# Altium project controller.PrjPcb
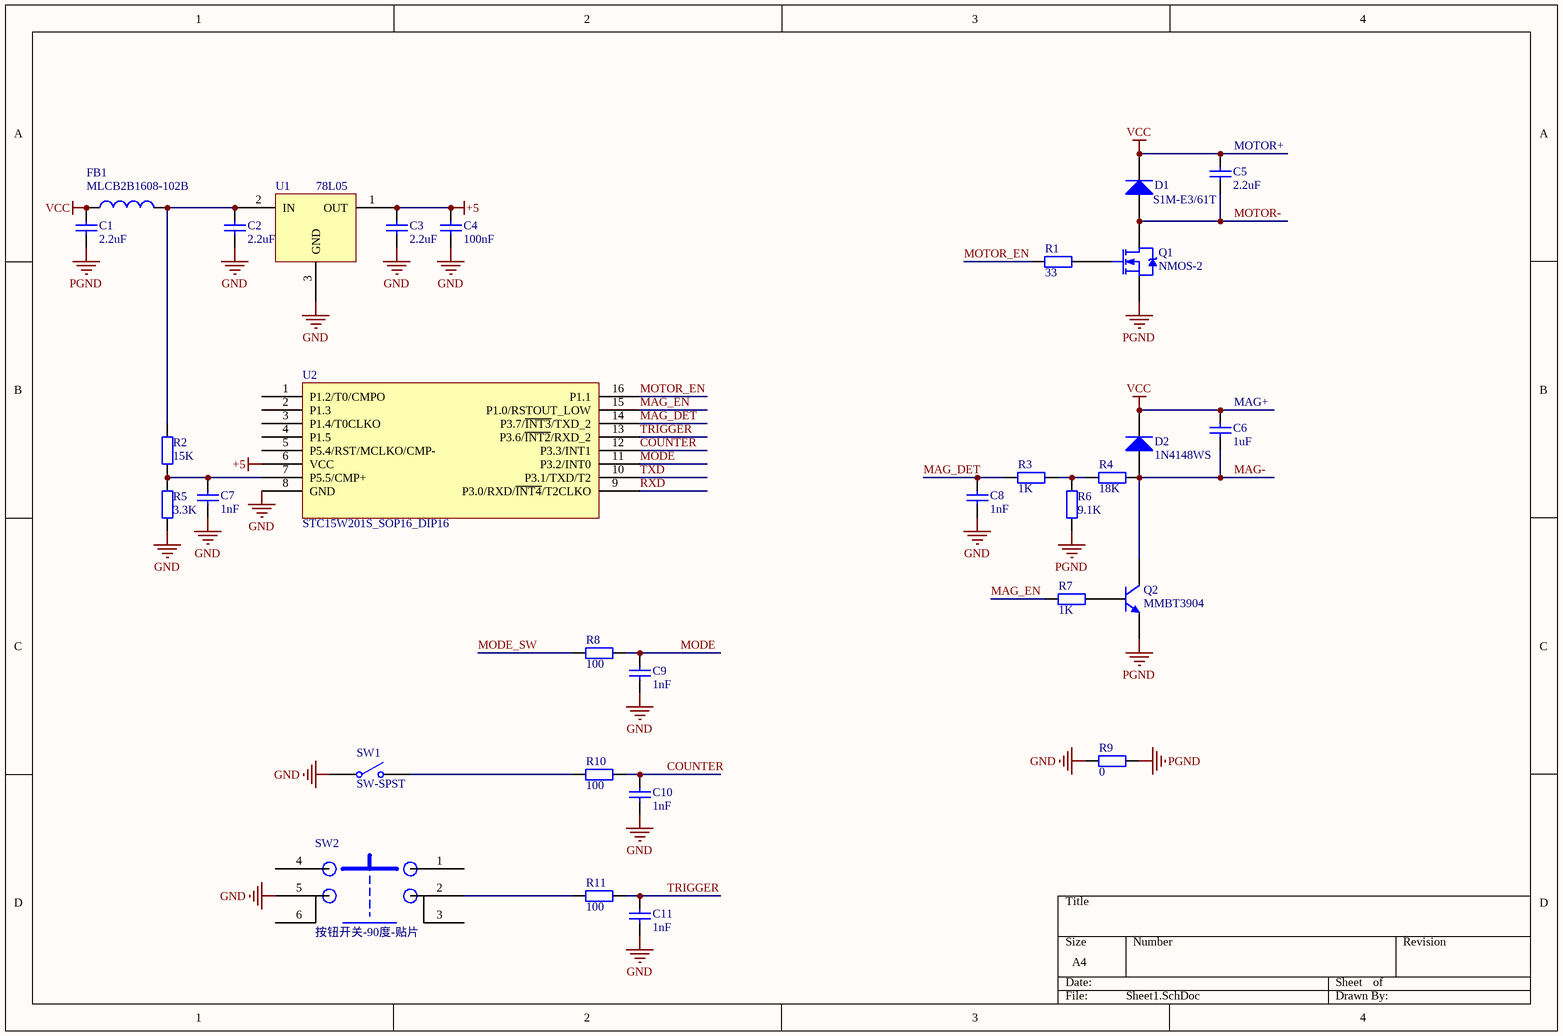
[diagram p0: Sheet1.SchDoc]
1 sheet, 31 parts. Net scope: global (net labels, ports and power ports of the same name join across sheets).
Board file: PCB1.PcbDoc

## Sheet Sheet1.SchDoc
size A4

### Parts
C1  value 2.2uF  [0805[cap]]  (hidden comment: CT41L-0805-2C1-25V-225K)
C2  value 2.2uF  [0805[cap]]  (hidden comment: CT41L-0805-2C1-25V-225K)
C3  value 2.2uF  [0805[cap]]  (hidden comment: CT41L-0805-2C1-25V-225K)
C4  value 100nF  [0603[cap]]  (hidden comment: CT41L-0603-2C1-50V-224K)
C5  value 2.2uF  [0805[cap]]  (hidden comment: CT41L-0805-2C1-25V-225K)
C6  value 1uF  [0603[cap]]  (hidden comment: CT41L-0603-2C1-50V-224K)
C7  value 1nF  [0603[cap]]  (hidden comment: CT41L-0603-2C1-50V-224K)
C8  value 1nF  [0603[cap]]  (hidden comment: CT41L-0603-2C1-50V-224K)
C9  value 1nF  [0603[cap]]  (hidden comment: CT41L-0603-2C1-50V-224K)
C10  value 1nF  [0603[cap]]  (hidden comment: CT41L-0603-2C1-50V-224K)
C11  value 1nF  [0603[cap]]  (hidden comment: CT41L-0603-2C1-50V-224K)
D1  S1M-E3/61T  [M7]
D2  1N4148WS  [SOD323]
FB1  MLCB2B1608-102B  [0603[bead]]
Q1  NMOS-2  [DPAK228P991X239-3N]
Q2  MMBT3904  [SOT23-3N]
R1  value 33  [0603[res]]  (hidden comment: RMK1608MB102J)
R2  value 15K  [0603[res]]  (hidden comment: RMK1608MB102J)
R3  value 1K  [0603[res]]  (hidden comment: RMK1608MB102J)
R4  value 18K  [0603[res]]  (hidden comment: RMK1608MB102J)
R5  value 3.3K  [0603[res]]  (hidden comment: RMK1608MB102J)
R6  value 9.1K  [0603[res]]  (hidden comment: RMK1608MB102J)
R7  value 1K  [0603[res]]  (hidden comment: RMK1608MB102J)
R8  value 100  [0603[res]]  (hidden comment: RMK1608MB102J)
R9  value 0  [0603[res]]  (hidden comment: RMK1608MB102J)
R10  value 100  [0603[res]]  (hidden comment: RMK1608MB102J)
R11  value 100  [0603[res]]  (hidden comment: RMK1608MB102J)
SW1  SW-SPST  [JJJHRGG200NOPMRTR]
SW2  按钮开关-90度-贴片  [按钮开关-90度-贴片]
U1  78L05  [SOT23-3N]
U2  STC15W201S_SOP16_DIP16  [SOP16]

### Nets
+5: C3.1 C4.1 U1.1(OUT) U2.6(VCC)
GND: C2.2 C3.2 C4.2 C7.2 C8.2 C9.2 C10.2 C11.2 R5.1 R9.1 SW1.1(COMMON) SW2.5 U1.3(GND) U2.8(GND)
PGND: C1.2 Q1.3(S) Q2.2(E) R6.1 R9.2
VCC: C1.1 C5.2 C6.1 D1.2(K) D2.2(K) FB1.1
COUNTER: C10.1 R10.2 U2.12(P3.3/INT1)
MAG-: C6.2 D2.1(A) Q2.3(C) R4.1
MAG_DET: C8.1 R3.1 U2.14(P3.7/~{INT3}/TXD_2)
MAG_EN: R7.1 U2.15(P1.0/RSTOUT_LOW)
MODE: C9.1 R8.2 U2.11(P3.2/INT0)
MODE_SW: R8.1
MOTOR-: C5.1 D1.1(A) Q1.2(D)
MOTOR_EN: R1.1 U2.16(P1.1)
RXD: U2.9(P3.0/RXD/~{INT4}/T2CLKO)
TRIGGER: C11.1 R11.2 U2.13(P3.6/~{INT2}/RXD_2)
TXD: U2.10(P3.1/TXD/T2)
NetC2_1: C2.1 FB1.2 R2.2 U1.2(IN)
NetC7_1: C7.1 R2.1 R5.2 U2.7(P5.5/CMP+)
NetQ1_1: Q1.1(G) R1.2
NetQ2_1: Q2.1(B) R7.2
NetR3_2: R3.2 R4.2 R6.2
NetR10_1: R10.1 SW1.2(NO)
NetR11_1: R11.1 SW2.2

Not connected (* = marked no-connect by the designer): SW2 1 3 4 6; U2 1(P1.2/T0/CMPO) 2(P1.3) 3(P1.4/T0CLKO) 4(P1.5) 5(P5.4/RST/MCLKO/CMP-)

### Notes on the sheet
- (near C5) MOTOR+
- (near C6) MAG+

### Library data of the parts
C1-C11 = Capacitor: Chip Capacitor
D1 = Diode 1N4007: 1 Amp General Purpose Rectifier
D2 = Diode: Default Diode
FB1 = bead: Chip Bead
Q1 = NMOS-2: N-Channel Power MOSFET; Note: Pin 2 is electrically connected to pin 4.; Published: 8-Jun-2000; LatestRevisionDate: 17-Jul-2002; LatestRevisionNote: Re-released for DXP Platform.; DatasheetVersion: PD-9.814; PackageVersion: Feb-1997; PackageReference: TO-220AB; Publisher: Altium Limited; PackageDescription: TO, Thru-Hole, Vertical, Heatsink Mounted; 3 In-Line Leads; Pitch 2.54 mm; ComponentLink1Description: Manufacturer Link; ComponentLink1URL: http://www.irf.com/
Q2 = MMBT3904: NPN General Purpose Amplifier
R1-R11 = Resistor
SW1 = SW-SPST: Single-Pole, Single-Throw Switch; Published: 24-Mar-1999; LatestRevisionDate: 17-Jul-2002; LatestRevisionNote: Re-released for DXP Platform.; PackageReference: SPST-2; Publisher: Altium Limited; PackageDescription: Switch; 2 Leads